# EAGLE schematic untitled (EAGLE 7.5.0)
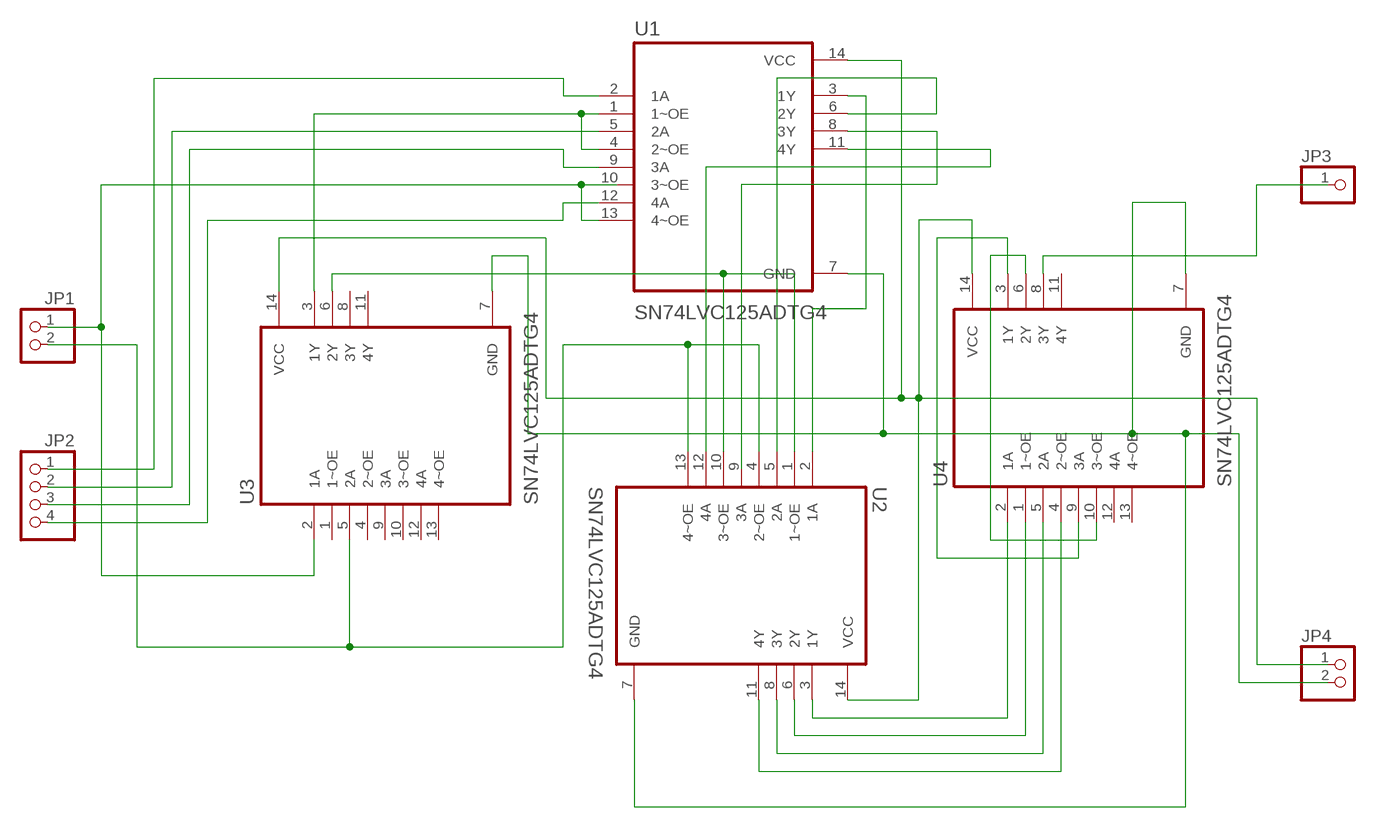
[diagram p0: schematic, sheet 1]

## Parts
JP1  PINHD-1X2  [1X02]
JP2  PINHD-1X4  [1X04]
JP3  PINHD-1X1  [1X01]
JP4  PINHD-1X2  [1X02]
U1  SN74LVC125ADTG4  [SOIC127P600X175-14N]
U2  SN74LVC125ADTG4  [SOIC127P600X175-14N]
U3  SN74LVC125ADTG4  [SOIC127P600X175-14N]
U4  SN74LVC125ADTG4  [SOIC127P600X175-14N]

## Nets
N$1: JP4.1 U1.14(VCC) U2.14(VCC) U3.14(VCC) U4.14(VCC)
N$2: JP2.3 U1.9(3A)
N$3: JP2.4 U1.12(4A)
N$4: JP1.1 U1.13(4~OE) U3.2(1A)
N$5: JP4.2 U1.7(GND) U2.7(GND) U3.7(GND) U4.7(GND)
N$6: JP2.1 U1.2(1A)
N$7: JP2.2 U1.5(2A)
N$8: U1.1(1~OE) U1.4(2~OE) U3.3(1Y)
N$9: U1.3(1Y) U2.2(1A)
N$10: U1.8(3Y)
N$11: U1.6(2Y) U2.5(2A)
N$12: U1.11(4Y) U2.12(4A)
N$13: JP1.2 U2.4(2~OE) U2.13(4~OE) U3.5(2A)
N$14: U2.1(1~OE) U2.10(3~OE) U3.6(2Y)
N$15: U2.3(1Y) U4.2(1A)
N$16: U2.6(2Y) U4.1(1~OE)
N$17: U2.8(3Y) U4.5(2A)
N$18: U2.11(4Y) U4.4(2~OE)
N$19: U4.3(1Y) U4.9(3A)
N$20: U4.6(2Y) U4.10(3~OE)
N$21: JP3.1 U4.8(3Y)
Unconnected: U1.10(3~OE) U2.9(3A) U3.1(1~OE) U3.4(2~OE) U3.8(3Y) U3.9(3A) U3.10(3~OE) U3.11(4Y) U3.12(4A) U3.13(4~OE) U4.11(4Y) U4.12(4A) U4.13(4~OE)

## Library data of the parts
JP1 JP4 = pinhead:PINHD-1X2: PIN HEADER
JP2 = pinhead:PINHD-1X4: PIN HEADER
JP3 = pinhead:PINHD-1X1: PIN HEADER
U1-U4 = SN74LVC125ADTG4:SN74LVC125ADTG4: Check availability <https://pricing.snapeda.com/parts/SN74LVC125ADTG4/Texas%20Instruments/view-part?ref=eda>; AVAILABILITY: In Stock; DESCRIPTION: Quadruple Bus Buffer Gate With 3-State Outputs 14-SOIC -40 to 125; MF: Texas Instruments; MP: SN74LVC125ADTG4; PACKAGE: SOIC-14 Texas Instruments; PRICE: None; PURCHASE-URL: https://pricing.snapeda.com/search/part/SN74LVC125ADTG4/?ref=eda

## Net classes
0 default: width 0.4 mm, clearance 0.25 mm